# EAGLE schematic kicker2 (EAGLE 4.16)
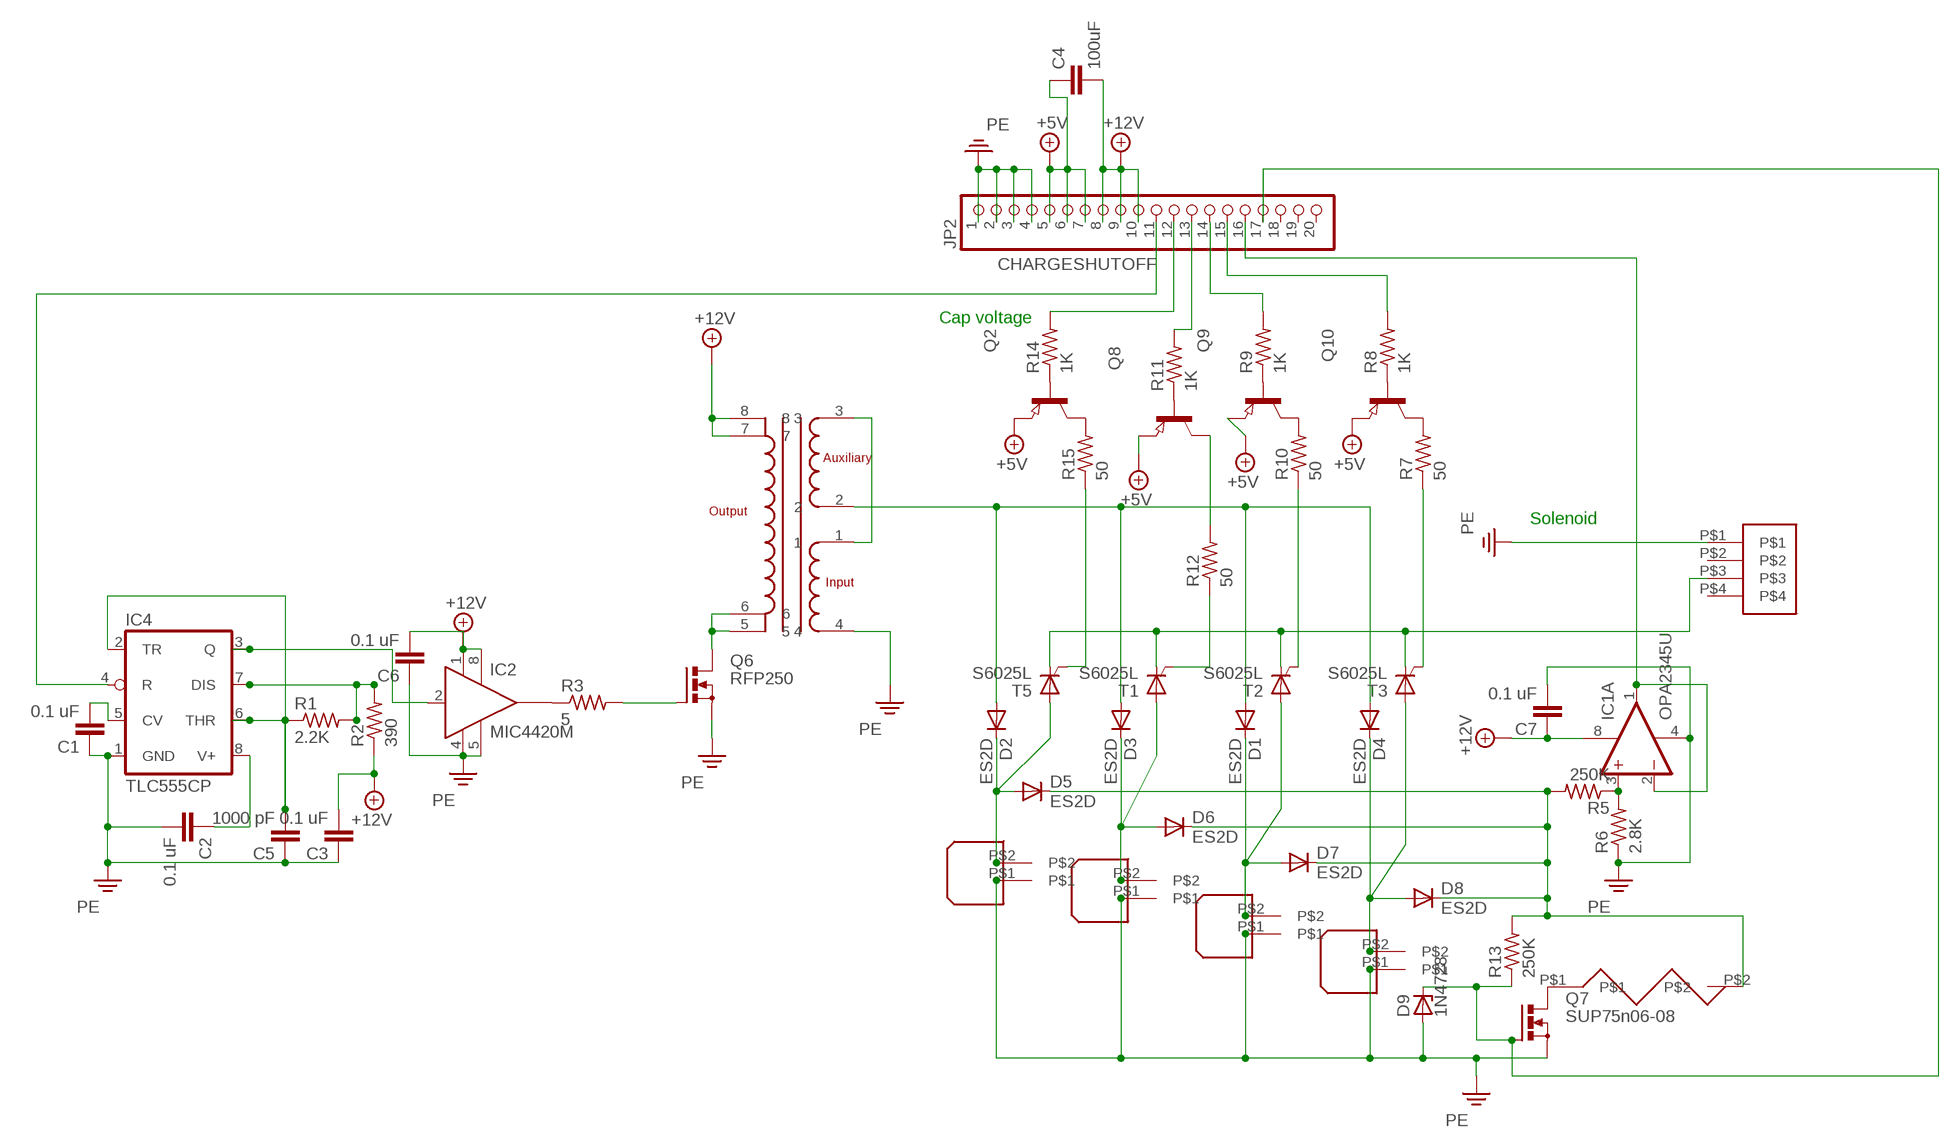
[diagram p0: schematic, sheet 1]

## Parts
C1  0.1 uF  C-EUC1206  [C1206]
C2  0.1 uF  C-EUC1206  [C1206]
C3  0.1 uF  C-EUC1206  [C1206]
C4  100uF  C-EU025-050X050  [C025-050X050]
C5  1000 pF  C-EUC1206  [C1206]
C6  0.1 uF  C-EUC1206  [C1206]
C7  0.1 uF  C-EUC1206  [C1206]
D1  ES2D  [SMB]
D2  ES2D  [SMB]
D3  ES2D  [SMB]
D4  ES2D  [SMB]
D5  ES2D  [SMB]
D6  ES2D  [SMB]
D7  ES2D  [SMB]
D8  ES2D  [SMB]
D9  1N4728  [DO41Z10]
IC1  OPA2345U  [SO08]
IC2  MIC4420M  [SO-08]
IC4  TLC555CP  LM555D  [SO08]
JP2  PINHD-1X20  [1X20]
Q2  PNP-TRANSISTOR_SOT23W  [SOT23W]
Q6  RFP250  IRFP240  [TO247BV]
Q7  SUP75n06-08  PMOSFET_NTO220BV  [TO220BV]
Q8  PNP-TRANSISTOR_SOT23W  [SOT23W]
Q9  PNP-TRANSISTOR_SOT23W  [SOT23W]
Q10  PNP-TRANSISTOR_SOT23W  [SOT23W]
R1  2.2K  R-US_R1206  [R1206]
R2  390  R-US_R1206  [R1206]
R3  5  R-US_R1206  [R1206]
R5  250K  R-US_R1206  [R1206]
R6  2.8K  R-US_R1206  [R1206]
R7  50  R-US_R1206  [R1206]
R8  1K  R-US_R1206  [R1206]
R9  1K  R-US_R1206  [R1206]
R10  50  R-US_R1206  [R1206]
R11  1K  R-US_R1206  [R1206]
R12  50  R-US_R1206  [R1206]
R13  250K  R-US_R1206  [R1206]
R14  1K  R-US_R1206  [R1206]
R15  50  R-US_R1206  [R1206]
T1  S6025L  BTV58  [TO220CS]
T2  S6025L  BTV58  [TO220CS]
T3  S6025L  BTV58  [TO220CS]
T5  S6025L  BTV58  [TO220CS]
U$1  A0009-AL  [SM]
U$2  2PINHEADER  [2007]
U$3  2PINHEADER  [2007]
U$4  2PINHEADER  [2007]
U$5  2PINHEADER  [2007]
U$7  RESISTOR  [RESISTOR]
U$8  CONNECT  [CONNECT]

## Nets
+5V: C4.1 JP2.5 JP2.6 JP2.7 Q2.2(E) Q8.2(E) Q9.2(E) Q10.2(E)
+12V: C3.2 C4.2 C6.2 C7.1 IC1.8(A:V+) IC2.1(VS) IC2.8(VS1) JP2.8 JP2.9 JP2.10 R2.1 U$1.7 U$1.8
CHARGESHUTOFF: IC4.4(R) JP2.11
N$1: Q6.G R3.2
N$2: U$1.1 U$1.3
N$3: JP2.12 R14.2
N$4: IC2.6(OUT) R3.1
N$5: Q6.D U$1.5 U$1.6
N$6: D1.A D2.A D3.A D4.A U$1.2
N$7: D2.C D5.A T5.A U$2.P$2
N$8: D3.C D6.A T1.A U$3.P$2
N$9: D1.C D7.A T2.A U$5.P$2
N$10: D4.C D8.A T3.A U$4.P$2
N$11: D5.C D6.C D7.C D8.C R5.2 R13.2 U$7.P$2
N$12: Q7.D U$7.P$1
N$13: R7.1 T3.G
N$14: JP2.13 R11.2
N$16: IC1.1(A:OUT) IC1.2(A:-IN) JP2.16
N$17: IC4.7(DIS) R1.2 R2.2
N$18: C1.2 IC4.5(CV)
N$19: C2.1 IC4.8(V+)
N$20: JP2.15 R8.2
N$21: C5.2 IC4.2(TR) IC4.6(THR) R1.1
N$22: JP2.14 R9.2
N$23: IC1.3(A:+IN) R5.1 R6.2
N$24: IC2.2(IN) IC4.3(Q)
N$25: Q2.1(B) R14.1
N$26: Q2.3(C) R15.2
N$27: Q9.1(B) R9.1
N$28: Q9.3(C) R10.2
N$29: T1.C T2.C T3.C T5.C U$8.P$3
N$30: Q8.1(B) R11.1
N$31: Q10.3(C) R7.2
N$32: R12.1 T1.G
N$33: Q8.3(C) R12.2
N$34: Q10.1(B) R8.1
N$35: R10.1 T2.G
N$36: R15.1 T5.G
N$38: D9.C JP2.17 Q7.G R13.1
PE: C1.1 C2.2 C3.1 C5.1 C6.1 C7.2 D9.A IC1.4(A:V-) IC2.4(GND) IC2.5(GND1) IC4.1(GND) JP2.1 JP2.2 JP2.3 JP2.4 Q6.S Q7.S R6.1 U$1.4 U$2.P$1 U$3.P$1 U$4.P$1 U$5.P$1 U$8.P$1
Unconnected: IC1.5(B:+IN) IC1.6(B:-IN) IC1.7(B:OUT) IC2.7(OUT) JP2.18 JP2.19 JP2.20 U$8.P$2 U$8.P$4

## Notes on the sheet
- Cap voltage
- Solenoid

## Library data of the parts
C1-C7 = rcl:C-EU: CAPACITOR, European symbol
D1-D8 = diode:ES2D: DIODE super fast rectifier, 2 A
D9 = diode:1N4728: Z DIODE 3.3 V, 1W, 5 percent
IC1 = linear:OPA2*: Dual Operational Amplifier Low Power, Single-Supply, Rail-To-Rail Operational Amplifier Source: http://focus.ti.com/lit/ds/symlink/opa2345.pdf
IC2 = transistor-power:MIC4420: 6A-Peak Low-Side MOSFET Driver Bipolar/CMOS/DMOS Process http://www.micrel.com/_PDF/mic4420.pdf
IC4 = linear:*555: TIMER
JP2 = pinhead:PINHD-1X20: PIN HEADER
Q2 Q8-Q10 = semicon-smd-ipc:PNP-TRANSISTOR_: PNP TRANSISTOR
Q6 = transistor-power:IRFP240: HEXFET Power MosFet Source: http://www.irf.com/
Q7 = transistor-power:PMOSFET_N: Power MOSFET N-Channel
R1-R3 R5-R15 = rcl:R-US_: RESISTOR, American symbol
T1-T3 T5 = triac:BTV58: THYRISTOR
U$1 = Kicker:A0009-AL
U$2-U$5 = kickerHeader:2PINHEADER
U$7 = kickerHeader:RESISTOR
U$8 = 19inch:CONNECT